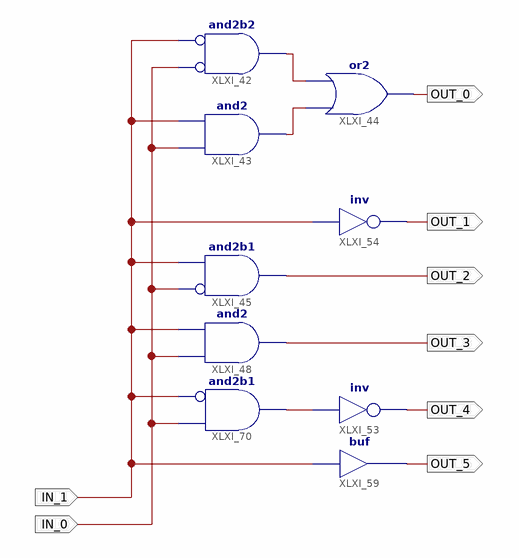
[diagram p0: schematic sheet 1]
// Xilinx ISE schematic LABA1.sch (spartan3a) as structural Verilog: 9 symbols, 8 ports
module LABA1 (
  input  IN_0,
  input  IN_1,
  output OUT_0,
  output OUT_2,
  output OUT_3,
  output OUT_1,
  output OUT_5,
  output OUT_4
);

  wire XLXN_31, XLXN_32, XLXN_37;

  and XLXI_42 (XLXN_31, ~IN_0, ~IN_1);  // and2b2
  and XLXI_43 (XLXN_32, IN_0, IN_1);
  or XLXI_44 (OUT_0, XLXN_32, XLXN_31);
  and XLXI_48 (OUT_3, IN_0, IN_1);
  not XLXI_54 (OUT_1, IN_1);
  and XLXI_45 (OUT_2, ~IN_0, IN_1);  // and2b1
  not XLXI_53 (OUT_4, XLXN_37);
  and XLXI_70 (XLXN_37, ~IN_1, IN_0);  // and2b1
  buf XLXI_59 (OUT_5, IN_1);
endmodule
